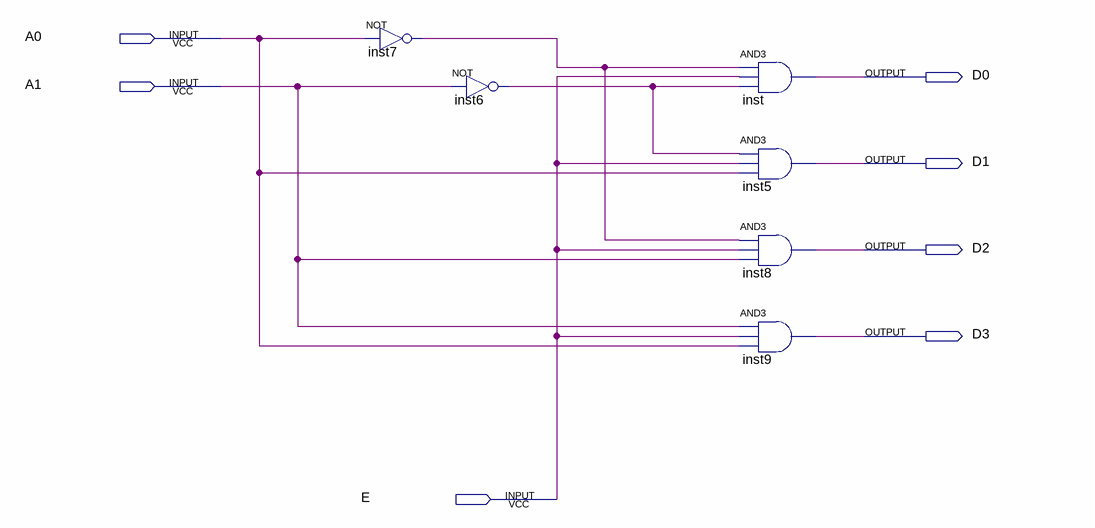
[diagram p0: schematic sheet]
// Quartus schematic codificador_teste.bdf as structural Verilog: 6 symbols, 7 pins
module codificador_teste (
  input  A0,
  input  A1,
  input  E,
  output D0,
  output D1,
  output D2,
  output D3
);

  wire inst6_out, inst7_out;

  not inst7 (inst7_out, A0);
  not inst6 (inst6_out, A1);
  and inst (D0, inst7_out, E, inst6_out);
  and inst5 (D1, inst6_out, E, A0);
  and inst8 (D2, inst7_out, E, A1);
  and inst9 (D3, A1, E, A0);
endmodule
